# EAGLE schematic sofi_v7_main (EAGLE 9.1.0)

## Sheet 1 of 2
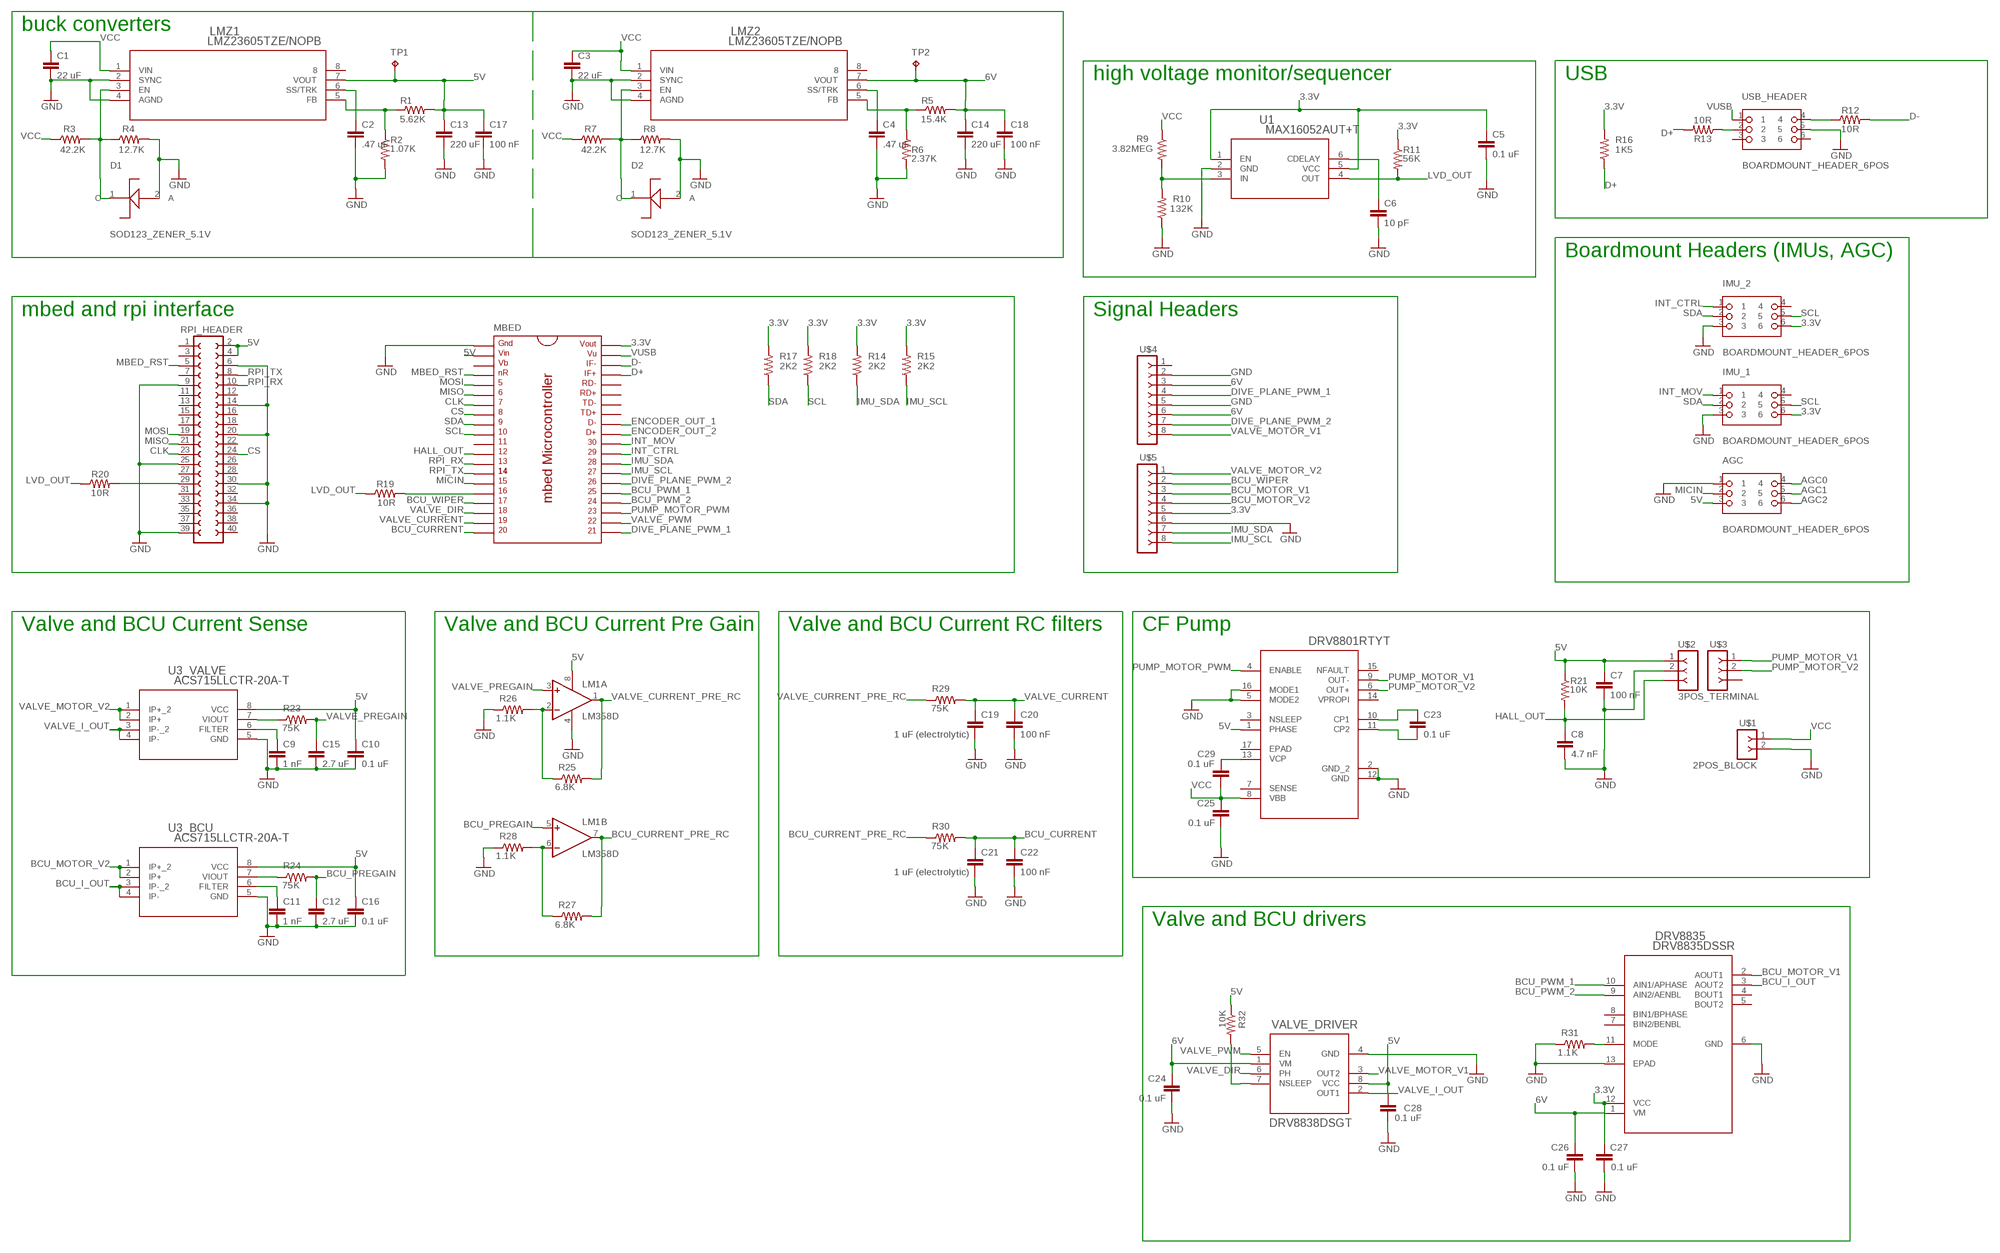
[diagram p0: schematic, sheet 1]

### Parts
AGC  BOARDMOUNT_HEADER_6POS  [BOARDMOUNT_HEADER]
C1  22 uF  C-EUC0805  [C0805]
C2  .47 uF  C-EUC0805  [C0805]
C3  22 uF  C-EUC0805  [C0805]
C4  .47 uF  C-EUC0805  [C0805]
C5  0.1 uF  C-EUC0805  [C0805]
C6  10 pF  C-EUC0603  [C0603]
C7  100 nF  C-EUC0805  [C0805]
C8  4.7 nF  C-EUC0805  [C0805]
C9  1 nF  C-EUC0603  [C0603]
C10  0.1 uF  C-EUC0603  [C0603]
C11  1 nF  C-EUC0603  [C0603]
C12  2.7 uF  C-EUC0603  [C0603]
C13  220 uF  C-EUC1206  [C1206]
C14  220 uF  C-EUC1206  [C1206]
C15  2.7 uF  C-EUC0603  [C0603]
C16  0.1 uF  C-EUC0603  [C0603]
C17  100 nF  C-EUC0805  [C0805]
C18  100 nF  C-EUC0805  [C0805]
C19  1 uF (electrolytic)  C-EUC0603  [C0603]
C20  100 nF  C-EUC0805  [C0805]
C21  1 uF (electrolytic)  C-EUC0603  [C0603]
C22  100 nF  C-EUC0805  [C0805]
C23  0.1 uF  C-EUC0805  [C0805]
C24  0.1 uF  C-EUC0603  [C0603]
C25  0.1 uF  C-EUC0603  [C0603]
C26  0.1 uF  C-EUC0603  [C0603]
C27  0.1 uF  C-EUC0603  [C0603]
C28  0.1 uF  C-EUC0603  [C0603]
C29  0.1 uF  C-EUC0805  [C0805]
D1  SOD123_ZENER_5.1V  [SOD123_ZENER]
D2  SOD123_ZENER_5.1V  [SOD123_ZENER]
DRV8801  DRV8801RTYT  [RTY16]
DRV8835  DRV8835DSSR  [DSS12_P9X2]
IMU_1  BOARDMOUNT_HEADER_6POS  [BOARDMOUNT_HEADER]
IMU_2  BOARDMOUNT_HEADER_6POS  [BOARDMOUNT_HEADER]
LM1  LM358D  [SO08]
LMZ1  LMZ23605TZE/NOPB  [TZA07A]
LMZ2  LMZ23605TZE/NOPB  [TZA07A]
MBED  MBED_MICROCONTROLLER  [DIL40_0.9]
R1  5.62K  R-US_M0805  [M0805]
R2  1.07K  R-US_M0805  [M0805]
R3  42.2K  R-US_M0805  [M0805]
R4  12.7K  R-US_M0805  [M0805]
R5  15.4K  R-US_M0805  [M0805]
R6  2.37K  R-US_M0805  [M0805]
R7  42.2K  R-US_M0805  [M0805]
R8  12.7K  R-US_M0805  [M0805]
R9  3.82MEG  RESISTOR0603  [0603]
R10  132K  RESISTOR0603  [0603]
R11  56K  R-US_R0603  [R0603]
R12  10R  RESISTOR0603  [0603]
R13  10R  RESISTOR0603  [0603]
R14  2K2  RESISTOR0603  [0603]
R15  2K2  RESISTOR0603  [0603]
R16  1K5  RESISTOR0603  [0603]
R17  2K2  RESISTOR0603  [0603]
R18  2K2  RESISTOR0603  [0603]
R19  10R  RESISTOR0603  [0603]
R20  10R  RESISTOR0603  [0603]
R21  10K  R-US_M0805  [M0805]
R23  75K  R-US_M0805  [M0805]
R24  75K  R-US_M0805  [M0805]
R25  6.8K  R-US_M0805  [M0805]
R26  1.1K  R-US_M0805  [M0805]
R27  6.8K  R-US_M0805  [M0805]
R28  1.1K  R-US_M0805  [M0805]
R29  75K  R-US_M0805  [M0805]
R30  75K  R-US_M0805  [M0805]
R31  1.1K  R-US_M0805  [M0805]
R32  10K  R-US_M0805  [M0805]
RPI_HEADER  FE20-2  [FE20-2]
TP1  TPB1,27  [B1,27]
TP2  TPB1,27  [B1,27]
U1  MAX16052AUT+T  [21-0058I]
U3_BCU  ACS715LLCTR-20A-T  [SOIC-8]
U3_VALVE  ACS715LLCTR-20A-T  [SOIC-8]
U$1  2POS_BLOCK  [2POS_BLOCK]
U$2  3POS_TERMINAL  [3POS_TERMINAL]
U$3  3POS_TERMINAL  [3POS_TERMINAL]
U$4  8POS_TERMINAL  [8POS_TERMINAL]
U$5  8POS_TERMINAL  [8POS_TERMINAL]
USB_HEADER  BOARDMOUNT_HEADER_6POS  [BOARDMOUNT_HEADER]
VALVE_DRIVER  DRV8838DSGT  [DSG8_P9X1P6]

### Nets
3.3V: C5.1 C27.1 DRV8835.12(VCC) IMU_1.6 IMU_2.6 MBED.40 R11.1 R14.2 R15.2 R16.2 R17.2 R18.2 U1.1(EN) U1.5(VCC) U$5.5
5V: AGC.3 C7.1 C10.1 C13.1 C16.1 C17.1 C28.1 DRV8801.1(PHASE) LM1.8(P:V+) LMZ1.7(VOUT) MBED.2 R1.2 R21.1 R32.1 RPI_HEADER.2 RPI_HEADER.4 TP1.TP U3_BCU.8(VCC) U3_VALVE.8(VCC) U$2.1 VALVE_DRIVER.8(VCC)
6V: C14.1 C18.1 C24.1 C26.1 DRV8835.1(VM) LMZ2.7(VOUT) R5.2 TP2.TP U$4.3 U$4.6 VALVE_DRIVER.1(VM)
AGC0: AGC.4
AGC1: AGC.5
AGC2: AGC.6
BCU_CURRENT: C21.1 C22.1 MBED.20 R30.2
BCU_CURRENT_PRE_RC: LM1.7(B:OUT) R27.2 R30.1
BCU_I_OUT: DRV8835.3(AOUT2) U3_BCU.3(IP-_2) U3_BCU.4(IP-)
BCU_MOTOR_V1: DRV8835.2(AOUT1) U$5.3
BCU_MOTOR_V2: U3_BCU.1(IP+_2) U3_BCU.2(IP+) U$5.4
BCU_PREGAIN: C12.1 LM1.5(B:+IN) R24.2
BCU_PWM_1: DRV8835.10(AIN1/APHASE) MBED.25
BCU_PWM_2: DRV8835.9(AIN2/AENBL) MBED.24
BCU_WIPER: MBED.17 U$5.2
CLK: MBED.7 RPI_HEADER.23
CS: MBED.8 RPI_HEADER.24
D+: MBED.37 R13.2 R16.1
D-: MBED.38 R12.2
DIVE_PLANE_PWM_1: MBED.21 U$4.4
DIVE_PLANE_PWM_2: MBED.26 U$4.7
ENCODER_OUT_1: MBED.32
ENCODER_OUT_2: MBED.31
GND: AGC.1 C1.2 C2.2 C3.2 C4.2 C5.2 C6.2 C7.2 C8.2 C9.2 C10.2 C11.2 C12.2 C13.2 C14.2 C15.2 C16.2 C17.2 C18.2 C19.2 C20.2 C21.2 C22.2 C24.2 C25.2 C26.2 C27.2 C28.2 D1.2(A) D2.2(A) DRV8801.2(GND_2) DRV8801.5(MODE2) DRV8801.12(GND) DRV8801.16(MODE1) DRV8835.6(GND) DRV8835.13(EPAD) IMU_1.3 IMU_2.3 LM1.4(P:V-) LMZ1.2(SYNC) LMZ1.4(AGND) LMZ2.2(SYNC) LMZ2.4(AGND) MBED.1 R2.2 R4.2 R6.2 R8.2 R10.1 R26.1 R28.1 R31.1 RPI_HEADER.6 RPI_HEADER.9 RPI_HEADER.14 RPI_HEADER.20 RPI_HEADER.25 RPI_HEADER.30 RPI_HEADER.34 RPI_HEADER.39 U1.2(GND) U3_BCU.5(GND) U3_VALVE.5(GND) U$1.2 U$2.2 U$4.2 U$4.5 U$5.6 USB_HEADER.5 VALVE_DRIVER.4(GND)
HALL_OUT: C8.1 MBED.12 R21.2 U$2.3
IMU_SCL: MBED.27 R15.1 U$5.8
IMU_SDA: MBED.28 R14.1 U$5.7
INT_CTRL: IMU_2.1 MBED.29
INT_MOV: IMU_1.1 MBED.30
LVD_OUT: R11.2 R19.1 R20.1 U1.4(OUT)
MBED_RST: MBED.4 RPI_HEADER.5
MICIN: AGC.2 MBED.15
MISO: MBED.6 RPI_HEADER.21
MOSI: MBED.5 RPI_HEADER.19
N$1: R20.2 RPI_HEADER.29
N$2: C23.1 DRV8801.10(CP1)
N$6: LMZ1.5(FB) R1.1 R2.1
N$7: R9.2 R10.2 U1.3(IN)
N$8: D1.1(C) LMZ1.3(EN) R3.2 R4.1
N$9: C4.1 LMZ2.6(SS/TRK)
N$10: LMZ2.5(FB) R5.1 R6.1
N$11: C2.1 LMZ1.6(SS/TRK)
N$12: C6.1 U1.6(CDELAY)
N$13: D2.1(C) LMZ2.3(EN) R7.2 R8.1
N$16: R23.1 U3_VALVE.7(VIOUT)
N$18: C9.1 U3_VALVE.6(FILTER)
N$19: MBED.16 R19.2
N$20: R24.1 U3_BCU.7(VIOUT)
N$21: C11.1 U3_BCU.6(FILTER)
N$22: C23.2 DRV8801.11(CP2)
N$23: C29.1 DRV8801.13(VCP)
N$25: LM1.2(A:-IN) R25.1 R26.2
N$26: R12.1 USB_HEADER.4
N$27: LM1.6(B:-IN) R27.1 R28.2
N$28: R13.1 USB_HEADER.2
N$34: DRV8835.11(MODE) R31.2
N$42: R32.2 VALVE_DRIVER.7(NSLEEP)
PUMP_MOTOR_PWM: DRV8801.4(ENABLE) MBED.23
PUMP_MOTOR_V1: DRV8801.9(OUT-) U$3.1
PUMP_MOTOR_V2: DRV8801.6(OUT+) U$3.2
RPI_RX: MBED.13 RPI_HEADER.10
RPI_TX: MBED.14 RPI_HEADER.8
SCL: IMU_1.5 IMU_2.5 MBED.10 R18.1
SDA: IMU_1.2 IMU_2.2 MBED.9 R17.1
VALVE_CURRENT: C19.1 C20.1 MBED.19 R29.2
VALVE_CURRENT_PRE_RC: LM1.1(A:OUT) R25.2 R29.1
VALVE_DIR: MBED.18 VALVE_DRIVER.6(PH)
VALVE_I_OUT: U3_VALVE.3(IP-_2) U3_VALVE.4(IP-) VALVE_DRIVER.2(OUT1)
VALVE_MOTOR_V1: U$4.8 VALVE_DRIVER.3(OUT2)
VALVE_MOTOR_V2: U3_VALVE.1(IP+_2) U3_VALVE.2(IP+) U$5.1
VALVE_PREGAIN: C15.1 LM1.3(A:+IN) R23.2
VALVE_PWM: MBED.22 VALVE_DRIVER.5(EN)
VCC: C1.1 C3.1 C25.1 C29.2 DRV8801.8(VBB) LMZ1.1(VIN) LMZ2.1(VIN) R3.1 R7.1 R9.1 U$1.1
VUSB: MBED.39 USB_HEADER.1
Unconnected: DRV8801.3(NSLEEP) DRV8801.14(VPROPI) DRV8801.15(NFAULT) DRV8801.17(EPAD) DRV8835.4(BOUT1) DRV8835.5(BOUT2) DRV8835.7(BIN2/BENBL) DRV8835.8(BIN1/BPHASE) IMU_1.4 IMU_2.4 LMZ1.8 LMZ2.8 MBED.3 MBED.11 MBED.33 MBED.34 MBED.35 MBED.36 RPI_HEADER.1 RPI_HEADER.3 RPI_HEADER.7 RPI_HEADER.11 RPI_HEADER.12 RPI_HEADER.13 RPI_HEADER.15 RPI_HEADER.16 RPI_HEADER.17 RPI_HEADER.18 RPI_HEADER.22 RPI_HEADER.26 RPI_HEADER.27 RPI_HEADER.28 RPI_HEADER.31 RPI_HEADER.32 RPI_HEADER.33 RPI_HEADER.35 RPI_HEADER.36 RPI_HEADER.37 RPI_HEADER.38 RPI_HEADER.40 U$3.3 U$4.1 USB_HEADER.3 USB_HEADER.6

### Notes on the sheet
- buck converters
- high voltage monitor/sequencer | USB
- Boardmount Headers (IMUs, AGC)
- mbed and rpi interface | Signal Headers
- Valve and BCU Current Sense | Valve and BCU Current Pre Gain | Valve and BCU Current RC filters | CF Pump
- Valve and BCU drivers

## Sheet 2 of 2

## Power pins joined to a net without a drawn wire
SENSE: DRV8801.7(SENSE)

## Library data of the parts
AGC IMU_1 IMU_2 USB_HEADER = 6pos connector:BOARDMOUNT_HEADER_6POS
C1-C12 C15-C29 = rcl:C-EU: CAPACITOR, European symbol; SPICEPREFIX: C
C13 C14 = resistor:C-EU: CAPACITOR, European symbol
D1 D2 = SOD123_ZENER_DIODE:SOD123_ZENER_5.1V
DRV8801 = DRV8801_ultra_librarian:DRV8801RTYT; MANUFACTURER_PART_NUMBER: DRV8801RTYT; VENDOR: Texas Instruments
DRV8835 = DRV8835_ultra_librarian:DRV8835DSSR; MANUFACTURER_PART_NUMBER: DRV8835DSSR; VENDOR: Texas Instruments
LM1 = linear:LM358: OP AMP also LM158; LM258; LM2904 Source: http://cache.national.com/ds/LM/LM158.pdf
LMZ1 LMZ2 = fish_lmz2_ti:LMZ23605TZE/NOPB; MANUFACTURER_PART_NUMBER: LMZ23605TZENOPB; VENDOR: Texas Instruments
MBED = mbed-microcontroller:MBED_MICROCONTROLLER: mbed Microcontroller, DIP40, 0.9"
R1-R8 R11 R21 R23-R32 = rcl:R-US_: RESISTOR, American symbol; SPICEPREFIX: R
R9 R10 R12-R20 = SparkFun-Resistors:RESISTOR: Generic Resistor Package
RPI_HEADER = con-lsta:FE20-2: FEMALE HEADER; OC_FARNELL: unknown; OC_NEWARK: unknown
TP1 TP2 = testpad:TP: Test pad
U1 = max:MAX16052AUT+T; MANUFACTURER_PART_NUMBER: max16052aut+t; VENDOR: Maxim Integrated Products
U3_BCU U3_VALVE = acs715:ACS715LLCTR-20A-T; MANUFACTURER_PART_NUMBER: ACS715LLCTR20AT; VENDOR: Allegro Microsystems Inc.
U$1 = 2pos_block_terminal:2POS_BLOCK
U$2 U$3 = 3pos_block_terminal:3POS_TERMINAL
U$4 U$5 = 8pos_block_terminal:8POS_TERMINAL
VALVE_DRIVER = DRV8838:DRV8838DSGT; MANUFACTURER_PART_NUMBER: DRV8838DSGT; VENDOR: Texas Instruments